# EAGLE design TinySpectrometer-mk-1.0 (EAGLE 7.5.0)
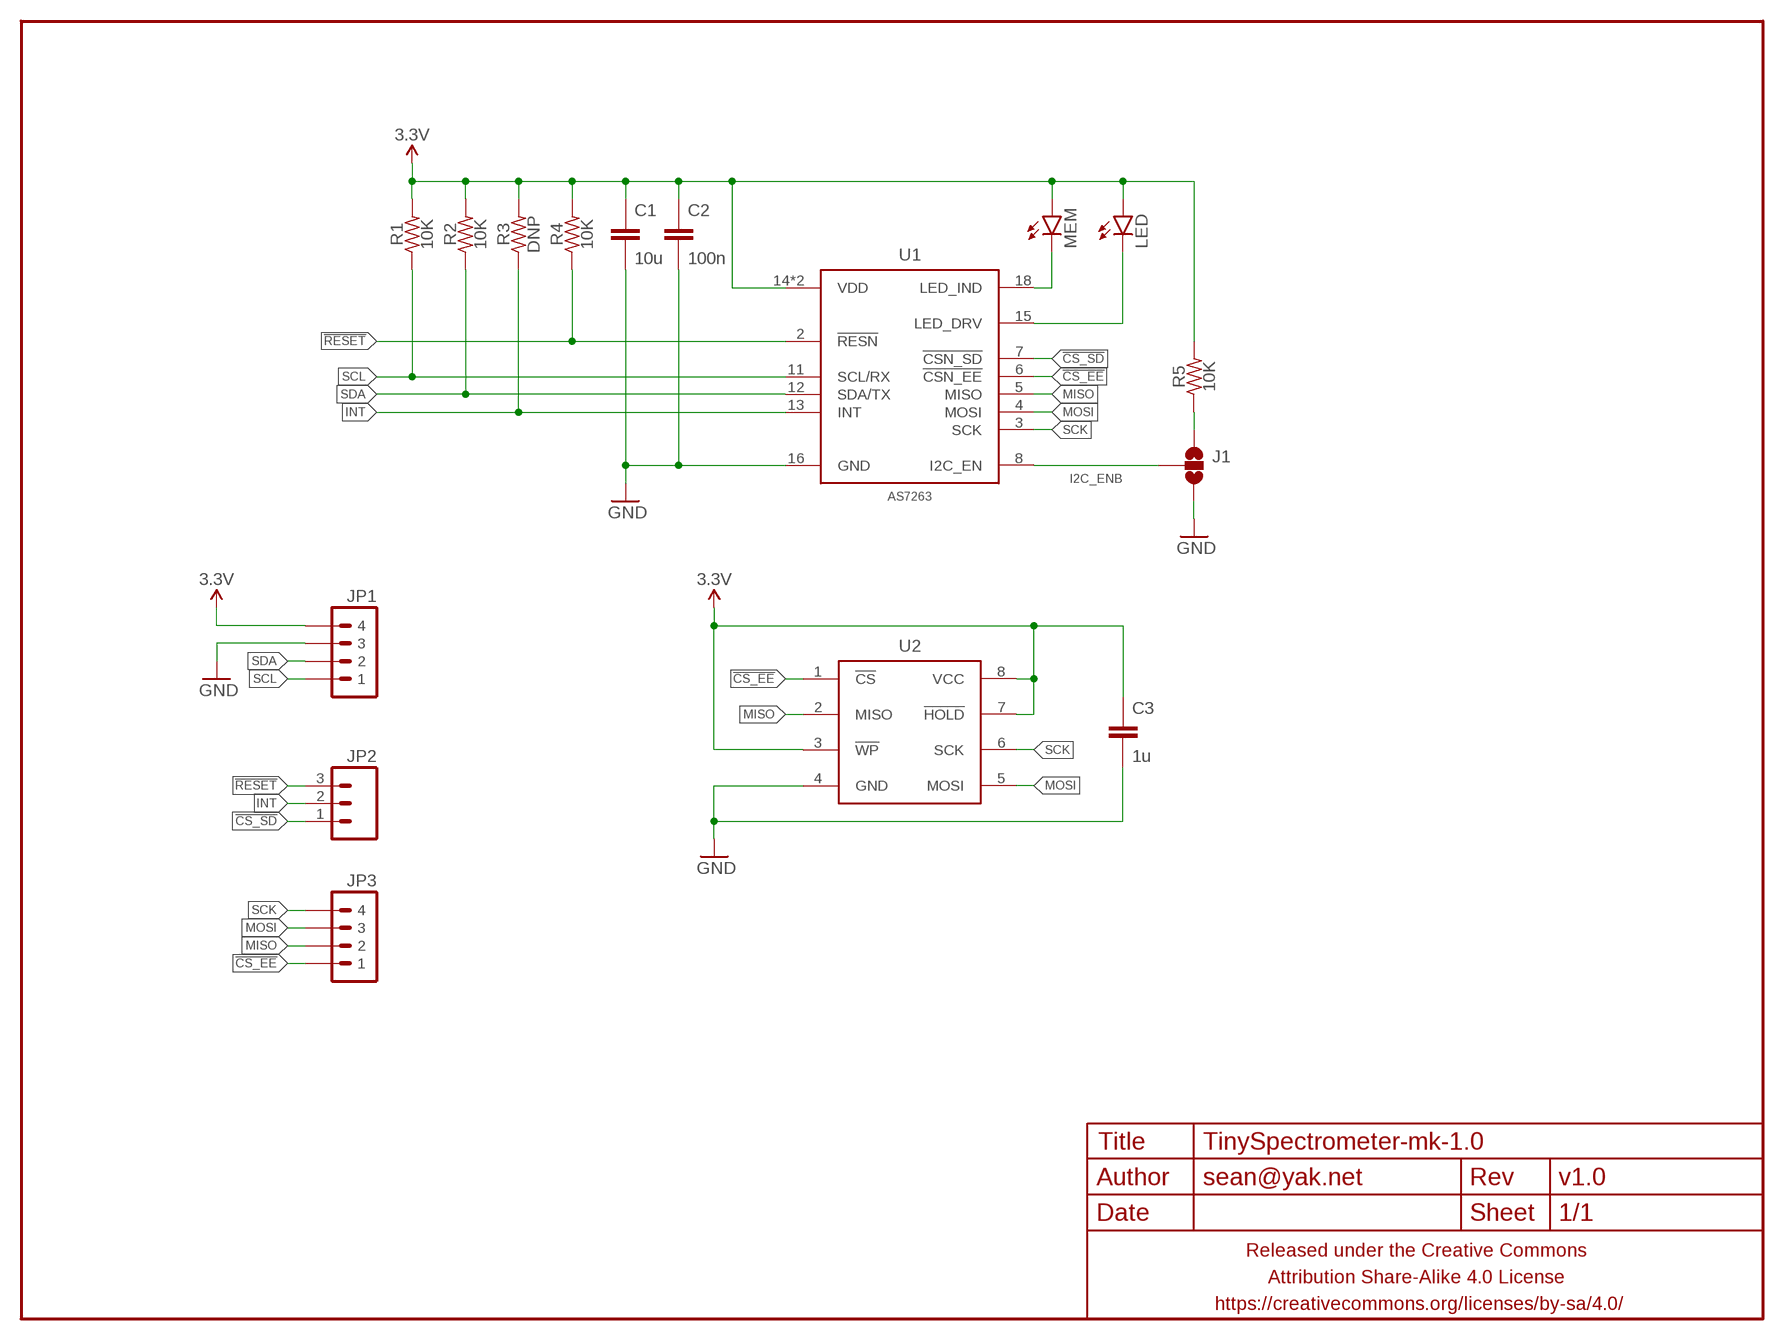
[diagram p0: schematic, sheet 1]

## Parts
C1  10u  CAPACITOR-CERAMICC0603-TIGHTER  [C0603-TIGHTER]
C2  100n  CAPACITOR-CERAMICC0603-TIGHTER  [C0603-TIGHTER]
C3  1u  CAPACITOR-CERAMICC0603-TIGHTER  [C0603-TIGHTER]
FRAME1  FRAME-LETTERNO_PACKAGE  [DUMMY]
J1  JUMPER-PAD-3-NOSMALLER  [PAD-JUMPER-3-NO_YES_SILK_FULL_BOX_SMALLER]
JP1  M04PTH-CENTERED  [1X04-PTH-VERT-CENTER]
JP2  M03PTH-CENTERED  [1X03-CENTERED]
JP3  M04PTH-CENTERED  [1X04-PTH-VERT-CENTER]
LED  LED1206  [LED-1206]
MEM  LED0603-TIGHT  [LED-0603-TIGHT]
R1  10K  RESISTORR0603-TIGHTER  [R0603-TIGHTER]
R2  10K  RESISTORR0603-TIGHTER  [R0603-TIGHTER]
R3  DNP  RESISTORR0603-TIGHTER  [R0603-TIGHTER]
R4  10K  RESISTORR0603-TIGHTER  [R0603-TIGHTER]
R5  10K  RESISTORR0603-TIGHTER  [R0603-TIGHTER]
U1  AS7263  [AS7263-LGA20]
U2  SPI_FLASHSOIC  [SO08]

## Nets
3.3V: C1.1 C2.1 C3.1 JP1.4 LED.A MEM.A R1.2 R2.2 R3.2 R4.2 R5.2 U1.14(VDD) U1.17(VDD) U2.3(!WP) U2.7(!HOLD) U2.8(VCC)
!CS_EE: JP3.1 U1.6(!CSN_EE) U2.1(!CS)
!CS_SD: JP2.1 U1.7(!CSN_SD)
!RESET: JP2.3 R4.1 U1.2(!RESN)
GND: C1.2 C2.2 C3.2 J1.3 JP1.3 U1.16(GND) U2.4(GND)
I2C_ENB: J1.2 U1.8(I2C_EN)
INT: JP2.2 R3.1 U1.13(INT)
MISO: JP3.2 U1.5(MISO) U2.2(MISO)
MOSI: JP3.3 U1.4(MOSI) U2.5(MOSI)
N$1: MEM.C U1.18(LED_IND)
N$2: LED.C U1.15(LED_DRV)
N$3: J1.1 R5.1
SCK: JP3.4 U1.3(SCK) U2.6(SCK)
SCL: JP1.1 R1.1 U1.11(SCL/RX)
SDA: JP1.2 R2.1 U1.12(SDA/TX)

## Library data of the parts
C1-C3 = a_parts:CAPACITOR-CERAMIC: CAPACITOR, European symbol
FRAME1 = a_parts:FRAME-LETTER: Schematic Frame Standard 8.5x11 US Letter frame; DESIGNER: sean@yak.net; VERSION: v1.0
J1 = a_parts:JUMPER-PAD-3-NO
JP1 JP3 = a_parts:M04: Header 4 Standard 4-pin 0.1" header. Use with straight break away headers (SKU : PRT-00116), right angle break away headers (PRT-00553), swiss pins (PRT-00743), machine pins (PRT-00117), and female headers (PRT-00115). Molex polarized connector foot print use with SKU : PRT-08231 with associated crimp pins and housings. 1MM SMD Version SKU: PRT-10208
JP2 = a_parts:M03: Header 3 Standard 3-pin 0.1" header. Use with straight break away headers (SKU : PRT-00116), right angle break away headers (PRT-00553), swiss pins (PRT-00743), machine pins (PRT-00117), and female headers (PRT-00115). Molex polarized connector foot print use with SKU : PRT-08232 with associated crimp pins and housings.
LED MEM = a_parts:LED: LEDs Standard schematic elements and footprints for 5mm, 3mm, 1206, and 0603 sized LEDs. 5mm - Spark Fun Electronics SKU : COM-00529 (and others)
R1-R5 = a_parts:RESISTOR: RESISTOR, American symbol
U1 = a_parts:AS7263
U2 = a_parts:SPI_FLASH

## Board
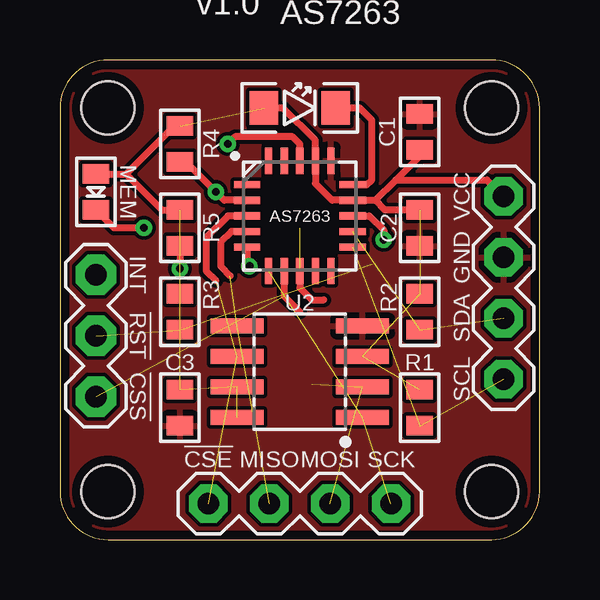
[diagram p1: board, top side]
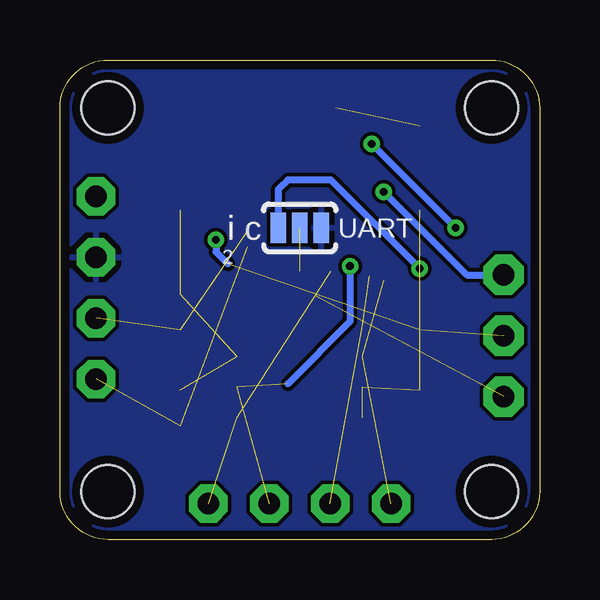
[diagram p2: board, bottom side, seen from below]

Size 20 x 20 mm. Coordinates in mm from the lower left corner, seen from the top.
Outline: 0,18 0,2 arc90 2,0 18,0 arc90 20,2 20,18 arc90 18,20 2,20 arc90 0,18
Copper layers (1*16): Top 0.0356mm / dielectric 1.5011mm / Bottom 0.0356mm
Design rules "LaenPCBOrder2": minimum track width 6mil, minimum drill 13mil, track to track 6mil, track to pad 6mil, pad to pad 6mil, via to via 6mil, smd to smd 6mil, copper to edge 15mil, drill to drill 6mil, minimum pad ring 7mil, minimum via ring 7mil, stop-mask expansion 3mil, vias tented up to drill 20mil, thermal gap 10mil
Holes 2.2 mm at 2,2 2,18 18,2 18,18

### Footprints (pad centres in the part's own frame; a part is rotated, then mirrored left to right if it is on the bottom)
C0603-TIGHTER = smd 0.8 x 1.1: 1 -0.75,0; 2 0.75,0
PAD-JUMPER-3-NO_YES_SILK_FULL_BOX_SMALLER = smd 0.635 x 1.27: 1 -0.9,0; 2 0,0; 3 0.9,0
1X04-PTH-VERT-CENTER = drill 0.9 pad 1.6 octagon: 1 -3.81,0; 2 -1.27,0; 3 1.27,0; 4 3.81,0
1X03-CENTERED = drill 0.9 pad 1.7 octagon: 1 -2.54,0; 2 0,0; 3 2.54,0
LED-1206 = smd 1.2 x 1.4: A -1.5,0; C 1.5,0
LED-0603-TIGHT = smd 0.8 x 1.1: A 0.75,0; C -0.75,0
R0603-TIGHTER = smd 0.8 x 1.1: 1 -0.75,0; 2 0.75,0
AS7263-LGA20 = smd 1.1 x 0.3: 1 -2.2,1.3; 2 -2.2,0.65; 3 -2.2,0; 4 -2.2,-0.65; 5 -2.2,-1.3; 11 2.2,-1.3; 12 2.2,-0.65; 13 2.2,0; 14 2.2,0.65; 15 2.2,1.3 | smd 0.3 x 1.1: 6 -1.3,-2.3; 7 -0.65,-2.3; 8 0,-2.3; 9 0.65,-2.3; 10 1.3,-2.3; 16 1.3,2.3; 17 0.65,2.3; 18 0,2.3; 19 -0.65,2.3; 20 -1.3,2.3
SO08 = smd 0.61 x 2.21: 1 -1.905,-2.616; 2 -0.635,-2.616; 3 0.635,-2.616; 4 1.905,-2.616; 5 1.905,2.616; 6 0.635,2.616; 7 -0.635,2.616; 8 -1.905,2.616

### Placement (x,y rotation side)
C1  15,17 90 top
C2  15,13 270 top
C3  5,5.5 270 top
FRAME1  0,0 0 top
J1  10,13 0 bottom
JP1  18.5,10.5 90 top
JP2  1.5,8.5 90 top
JP3  10,1.5 180 top
LED  10,18 0 top
MEM  1.5,14.5 90 top
R1  15,5.5 90 top
R2  15,9.5 90 top
R3  5,9.5 90 top
R4  5,16.5 90 top
R5  5,13 90 top
U1  10,13.5 0 top
U2  10,7 90 top

### Tracks (layer width: path | path; a pad name or v marks a point on that pad's centre or on a via)
3.3V  (8 unrouted)
  Top 0.3: 13.15,14.15 U1.14 11.35,14.15 10.65,14.85 U1.17 10.65,16.65 9.3,18 LED.A | 13.15,14.15 14,15 | 14,15 17.81,15 JP1.4 | MEM.A 2.75,15.25 | 2.75,15.25 4.75,17.25 R4.2 | 2.75,15.25 4.25,13.75 R5.2 | C2.1 13.55,13.75 13.15,14.15 | C1.1 15,16 14,15
!CS_EE  (2 unrouted)
!CS_SD  (1 unrouted)
  Top 0.3: U1.7 9.35,10.15 10,9.5
!RESET  (via drill 0.33)
  Top 0.3: U1.2 6.85,14.15 v6.5,14.5 5.25,15.75 R4.1
  Bottom 0.3: v6.5,14.5 3.04,11.04 JP2.3
GND
  pour Top (rank 6): 0,18 0,2 arc90 2,0 18,0 arc90 20,2 20,18 arc90 18,20 2,20 arc90
  pour Bottom (rank 6): 20,18 20,2 arc-90 18,0 2,0 arc-90 0,2 0,18 arc-90 2,20 18,20 arc-90
I2C_ENB  (1 unrouted)
  Top 0.3: U1.8 10,10.5 10.5,10 11,10
INT  (via drill 0.33)  (2 unrouted)
  Top 0.3: U1.13 12.9,13.5 13.5,12.9 v13.5,12.5
  Bottom 0.3: v13.5,12.5 13.5,12 13,11.5
MISO  (via drill 0.33)  (2 unrouted)
  Top 0.3: U1.5 7.8,11.5 v7.9,11.4
  Bottom 0.3: v7.9,11.4 7.9,9.1 10.5,6.5
MOSI  (2 unrouted)
  Top 0.3: U1.4 7.15,12.85 6.7,12.4 6.7,11.4 7.1,11
N$1  (via drill 0.33)
  Top 0.3: U1.18 10,16.5 9.7,16.8 7.3,16.8 v7,16.5 | v3.5,13 2.25,13 MEM.C
  Bottom 0.3: v7,16.5 v3.5,13
N$2
  Top 0.3: U1.15 12.8,14.8 13,15 13,17.5 12.5,18 LED.C
N$3  (via drill 0.33)
  Top 0.3: R5.1 v5,11.3
  Bottom 0.3: v5,11.3 8.7,15 10.5,15 10.9,14.6 J1.1
SCK  (2 unrouted)
  Top 0.3: U1.3 7,13.5 6.1,12.6 6.1,11.2 6.5,10.8
SCL  (2 unrouted)
SDA  (2 unrouted)

### Text on the board
tPlace: AS7263 | VCC | GND | INT | SDA | !RST | SCL | !CSS | !CSE | MISO | MOSI | SCK
bPlace: UART | i c | 2